# Altium schematic sheet ESP32.SchDoc
size A; SheetNumber: 8; SheetTotal: 9
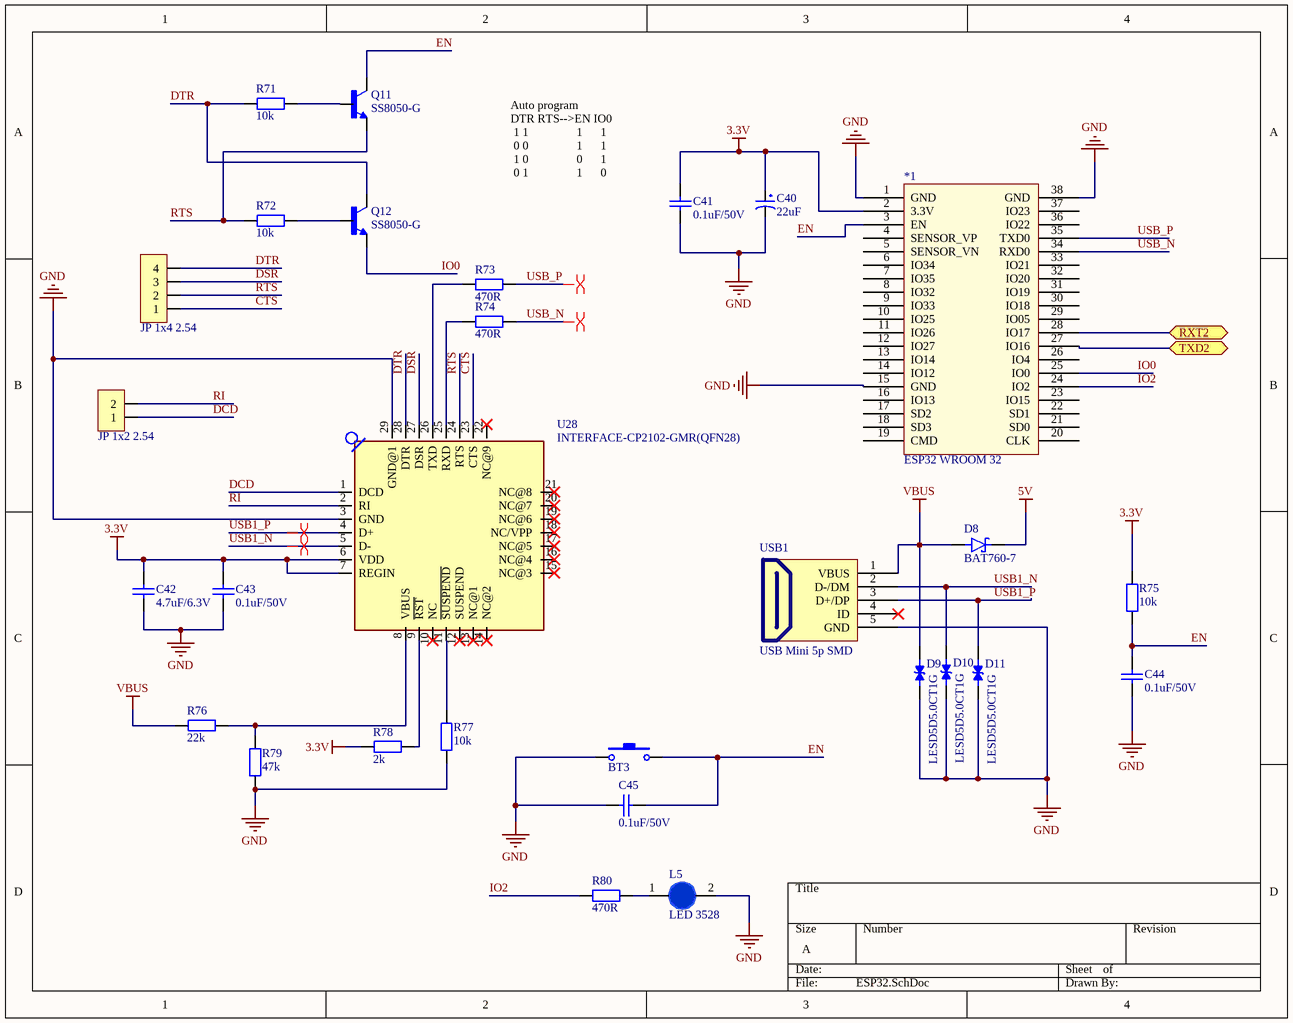
[diagram p0: ESP32.SchDoc]

## Parts
*1  ESP32 WROOM 32  [ESP32-WROOM-32D]
BT3  Nut Nhan 2 Chan SMD 3x6x2.5  [Nut Nhan 2 Chan SMD 3x6x2.5]  (value not drawn)
C40  22uF  [tu tantalum smd7343]
C41  0.1uF/50V  [tu 0805]
C42  4.7uF/6.3V  [tu 0805]
C43  0.1uF/50V  [tu 0805]
C44  0.1uF/50V  [tu 0805]
C45  0.1uF/50V  [tu 0805]
D8  BAT760-7  [SOD2513X120N]
D9  LESD5D5.0CT1G  [TVS_LESD5D5.0CT1G]
D10  LESD5D5.0CT1G  [TVS_LESD5D5.0CT1G]
D11  LESD5D5.0CT1G  [TVS_LESD5D5.0CT1G]
JP2  JP 1x4 2.54  [JP 1x4 DT]
JP3  JP 1x2 2.54  [JP 1x2 DT]
L5  LED 3528  [LED-3528-BLUE]
Q11  SS8050-G  [TRANS_SS8050-G]
Q12  SS8050-G  [TRANS_SS8050-G]
R71  10k  [tro smd 0805]
R72  10k  [tro smd 0805]
R73  470R  [Tro SMD 0805]
R74  470R  [Tro SMD 0805]
R75  10k  [tro smd 0805]
R76  22k  [tro smd 0805]
R77  10k  [tro smd 0805]
R78  2k  [Tro SMD 0805]
R79  47k  [tro smd 0805]
R80  470R  [Tro SMD 0805]
U28  INTERFACE-CP2102-GMR(QFN28)  [QFN28G_0.5-5X5MM]
USB1  USB Mini 5p SMD  [USB Mini 5p SMD]

## Ports
RXT2 (bidir), TXD2 (bidir)

## Nets
3.3V: *1.2(3.3V) C40.1 C41.2 C42.1 C43.1 R75.2 R78.1 U28.6(VDD) U28.7(REGIN)
5V: D8.C(K)
GND: *1.1(GND) *1.15(GND) *1.38(GND) BT3.1 C40.2 C41.1 C42.2 C43.2 C44.1 C45.2 D9.2 D10.2 D11.2 L5.2(K) R77.1 R79.2 U28.3(GND) U28.29(GND@1) USB1.5(GND)
VBUS: D8.A D9.1 R76.1 USB1.1(VBUS)
CTS: JP2.1 U28.23(CTS)
DCD: JP3.1 U28.1(DCD)
DSR: JP2.3 U28.27(DSR)
DTR: JP2.4 Q12.3(C) R71.1 U28.28(DTR)
EN: *1.3(EN) BT3.2 C44.2 C45.1 Q11.3(C) R75.1
IO0: *1.25(IO0) Q12.2(E)
IO2: *1.24(IO2) R80.1
RI: JP3.2 U28.2(RI)
RTS: JP2.2 Q11.2(E) R72.1 U28.24(RTS)
RXT2: *1.28(IO17) ; port RXT2
TXD2: *1.27(IO16) ; port TXD2
USB1_N: D10.1 U28.5(D-) USB1.2(D-/DM)
USB1_P: D11.1 U28.4(D+) USB1.3(D+/DP)
USB_N: *1.34(RXD0) R74.2
USB_P: *1.35(TXD0) R73.2
NetL5_1: L5.1(A) R80.2
NetQ11_1: Q11.1(B) R71.2
NetQ12_1: Q12.1(B) R72.2
NetR73_1: R73.1 U28.26(TXD)
NetR74_1: R74.1 U28.25(RXD)
NetR76_2: R76.2 R79.1 U28.8(VBUS)
NetR77_2: R77.2 U28.11(~{SUSPEND})
NetR78_2: R78.2 U28.9(~{RST})

Not connected (* = marked no-connect by the designer): *1 4(SENSOR_VP) 5(SENSOR_VN) 6(IO34) 7(IO35) 8(IO32) 9(IO33) 10(IO25) 11(IO26) 12(IO27) 13(IO14) 14(IO12) 16(IO13) 17(SD2) 18(SD3) 19(CMD) 20(CLK) 21(SD0) 22(SD1) 23(IO15) 26(IO4) 29(IO05) 30(IO18) 31(IO19) 32(IO20) 33(IO21) 36(IO22) 37(IO23); U28 10(NC)* 12(SUSPEND)* 13(NC@1)* 14(NC@2)* 15(NC@3)* 16(NC@4)* 17(NC@5)* 18(NC/VPP)* 19(NC@6)* 20(NC@7)* 21(NC@8)* 22(NC@9)*; USB1 4(ID)*

## Layout directives
differential pair: USB1_N, USB1_P, USB_N, USB_P

## Notes on the sheet
- Auto program
  DTR RTS-->EN IO0
  1 1                1      1
  0 0                1      1
  1 0                0      1
  0 1                1      0

## Library data of the parts
BT3 = Nut Nhan 2 Chan SMD 3x6x2.5: Ma_Hang: MH001036; Ten: Nút Nhấn 2 Chân 3x6x2.5MM SMD
C40 = Tu tantalum 22uF 25V SMD7343: Dán; Don_Vi: Con; So_Chan: 2; Ten_Linh_Kien: Tụ tantalum 226E-22uF 25V SMD7343; Ma_Hang: MH007975; Chung_Loai: Dán; Kieu_Chan: *
C41-C45 = Tu 0805 104 50V 10%: Dán; Don_Vi: Con; So_Chan: 2; Ten_Linh_Kien: Tụ 0805 104-100nF 10% 50V; Ma_Hang: MH004551; Chung_Loai: Dán; Kieu_Chan: *
D8 = BAT760-7: Diode Schottky 30V 1A 2-Pin SOD-323 T/R; MF: Diodes Zetex; MP: BAT760-7; SnapEDA_Link: https://www.snapeda.com/parts/BAT760-7/Zetex/view-part/4817231/?ref=snap; Value: *; DigiKey-Purchase-URL: https://snapeda.com/shop?store=DigiKey&id=4817231; Package: None; Mouser-Purchase-URL: https://snapeda.com/shop?store=Mouser&id=4817231; Price: None; Availability: Good
D9-D11 = LESD5D5.0CT1G: Transient Voltage Suppressors for ESD Protection; MF: Leshan Radio Co.; Check_prices: https://www.snapeda.com/parts/LESD5D5.0CT1G/Leshan+Radio+Co./view-part/?ref=eda; Value: *; Availability: Not in stock; Package: None; SnapEDA_Link: https://www.snapeda.com/parts/LESD5D5.0CT1G/Leshan+Radio+Co./view-part/?ref=snap; MP: LESD5D5.0CT1G; Price: None
JP2 = JP 1x4 2.54 Duc Thang: Cắm; Ten_Linh_Kien: Jump Đơn Đực 2.54MM 1x40P Thẳng 11MM; Don_Vi: Con; Ma_Hang: MH000903; Ghi_Chu: *; Kieu_Chan: *; Chung_Loai: Cắm
JP3 = JP 1x2 2.54 Duc Thang: Cắm; Ten_Linh_Kien: Jump Đơn Đực 2.54MM 1x40P Thẳng 11MM; Don_Vi: Con; Ma_Hang: MH000903; Ghi_Chu: *; Kieu_Chan: *; Chung_Loai: Cắm
L5 = LED 3528 Xanh Duong: Dán; Don_Vi: Con; Ma_Hang: MH005546; Ten_Linh_Kien: LED3528 Màu Xanh Dương; Ghi_Chu: *; Kieu_Chan: *; Chung_Loai: Dán
Q11 Q12 = SS8050-G: Bipolar (BJT) Transistor NPN 25 V 1.5 A 100MHz 300 mW Surface Mount SOT-23-3; MP: SS8050G; MF: Comchip; Digi-Key_Part_Number: 641-1790-2-ND; Check_prices: https://www.snapeda.com/parts/SS8050G/Comchip/view-part/?ref=eda; Package: None; SnapEDA_Link: https://www.snapeda.com/parts/SS8050G/Comchip/view-part/?ref=snap; Value: *
R71 R72 R75 R77 = Tro 0805 5% 10k: Dán; Don_Vi: Con; So_Chan: 2; Ten_Linh_Kien: Trở 0805 5% 10k; Ma_Hang: MH005239; Chung_Loai: Dán; Kieu_Chan: *
R73 R74 R80 = Tro 0805 5% 470R: Dán; Don_Vi: Con; Ma_Hang: MH005341; Ten_Linh_Kien: Trở 0805 5% 470R; So_Chan: 2; Chung_Loai: Dán; Kieu_Chan: *
R76 = Tro 0805 5% 22k: Dán; Don_Vi: Con; So_Chan: 2; Ten_Linh_Kien: Trở 0805 5% 22k; Ma_Hang: MH005248; Chung_Loai: Dán; Kieu_Chan: *
R78 = Tro 0805 5% 2k: Dán; Don_Vi: Con; So_Chan: 2; Ten_Linh_Kien: Trở 0805 5% 2k; Ma_Hang: MH005304; Chung_Loai: Dán; Kieu_Chan: *
R79 = Tro 0805 5% 47k: Dán; Don_Vi: Con; So_Chan: 2; Ten_Linh_Kien: Trở 0805 5% 47k; Ma_Hang: MH005320; Chung_Loai: Dán; Kieu_Chan: *
U28 = INTERFACE-CP2102-GMR(QFN28): USB Bridge, USB to UART USB 2.0 UART Interface 28-QFN (5x5); MF: Silicon; Price: None; Availability: In Stock; MP: CP2102-GMR; Package: VFQFN-28 Vishay Siliconix; SnapEDA_Link: https://www.snapeda.com/parts/CP2102-GMR/Silicon+Labs/view-part/?ref=snap; Check_prices: https://www.snapeda.com/parts/CP2102-GMR/Silicon+Labs/view-part/?ref=eda; Value: *; Purchase-URL: https://pricing.snapeda.com/search/part/CP2102-GMR/?ref=eda
USB1 = USB Mini 5p SMD: USB Type B; Ten: MiniUSB 5P SMD; Ma_Hang: MH001022